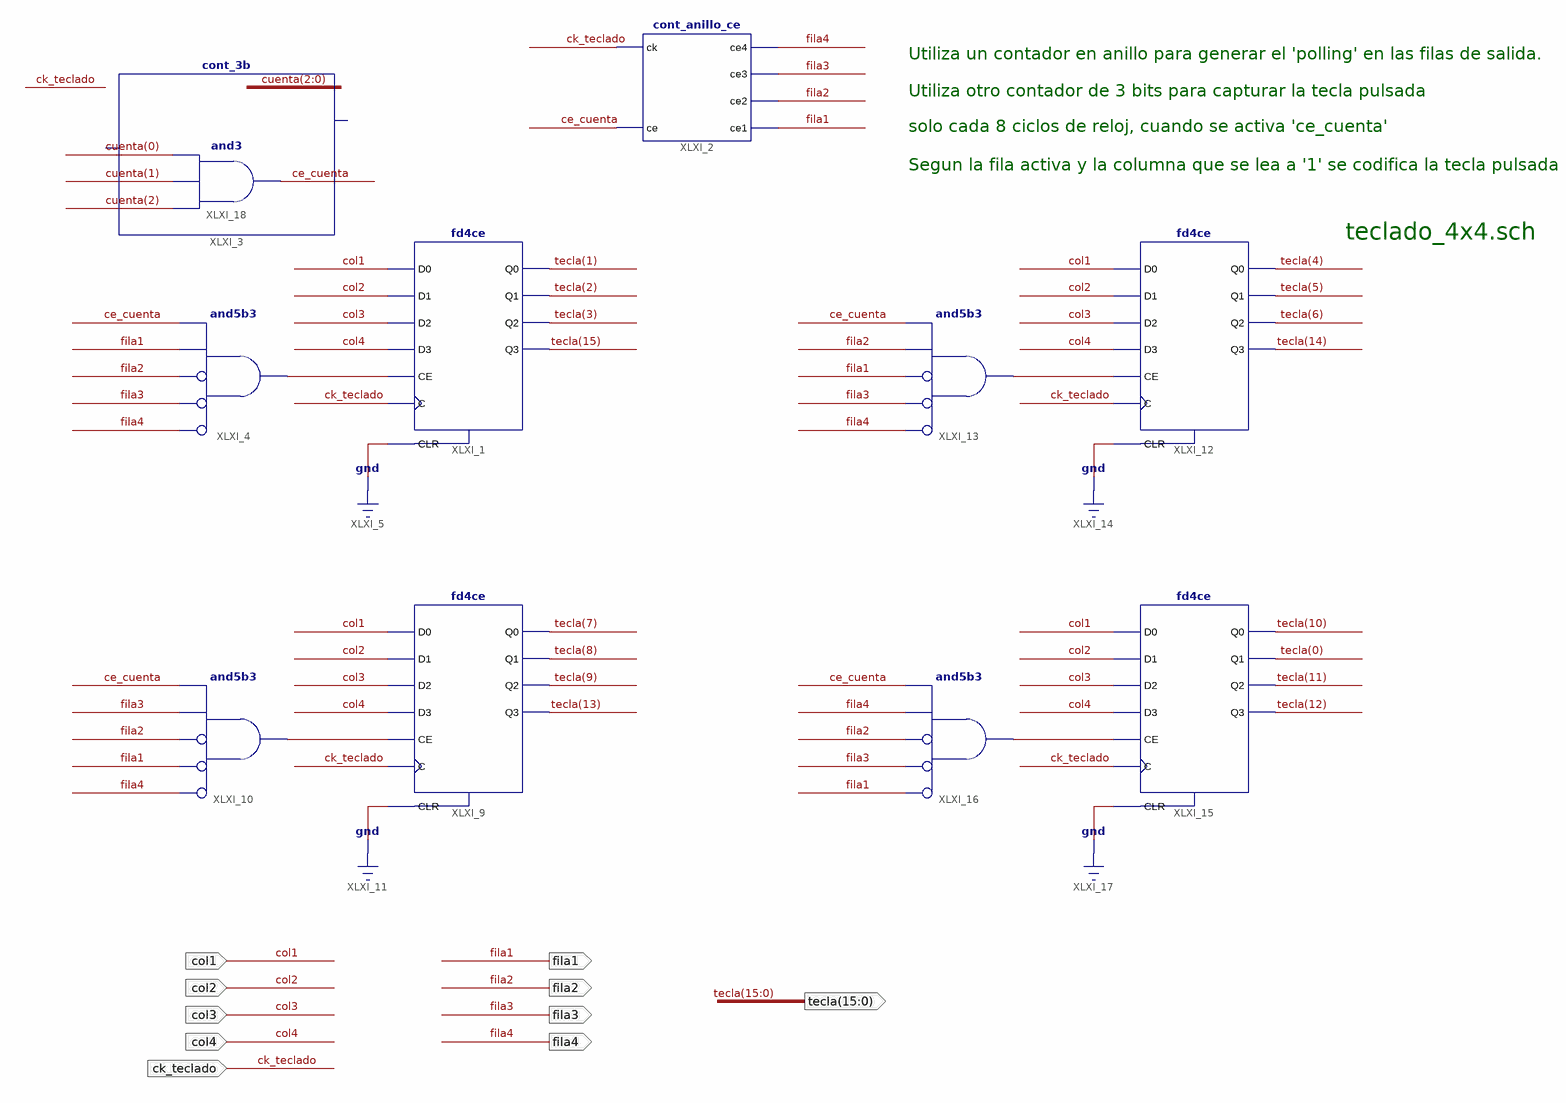
[diagram p0: schematic sheet 1]
// Xilinx ISE schematic teclado_4x4.sch (spartan6) as structural Verilog: 11 symbols, 11 ports
module teclado_4x4 (
  input  ck_teclado,
  input  col1,
  input  col2,
  input  col3,
  input  col4,
  output fila4,
  output fila3,
  output fila2,
  output fila1,
  output [15:0] tecla
);

  wire ce_cuenta, XLXN_13, XLXN_45, XLXN_61, XLXN_77;
  wire [2:0] cuenta;

  fd4ce XLXI_1 (
    .C(ck_teclado), .CE(XLXN_13), .CLR(1'b0), .D0(col1), .D1(col2), .D2(col3), .D3(col4), .Q0(tecla[1]),
    .Q1(tecla[2]), .Q2(tecla[3]), .Q3(tecla[15]));
  and XLXI_4 (XLXN_13, ~fila4, ~fila3, ~fila2, fila1, ce_cuenta);  // and5b3
  fd4ce XLXI_9 (
    .C(ck_teclado), .CE(XLXN_45), .CLR(1'b0), .D0(col1), .D1(col2), .D2(col3), .D3(col4), .Q0(tecla[7]),
    .Q1(tecla[8]), .Q2(tecla[9]), .Q3(tecla[13]));
  and XLXI_10 (XLXN_45, ~fila4, ~fila1, ~fila2, fila3, ce_cuenta);  // and5b3
  fd4ce XLXI_12 (
    .C(ck_teclado), .CE(XLXN_61), .CLR(1'b0), .D0(col1), .D1(col2), .D2(col3), .D3(col4), .Q0(tecla[4]),
    .Q1(tecla[5]), .Q2(tecla[6]), .Q3(tecla[14]));
  and XLXI_13 (XLXN_61, ~fila4, ~fila3, ~fila1, fila2, ce_cuenta);  // and5b3
  fd4ce XLXI_15 (
    .C(ck_teclado), .CE(XLXN_77), .CLR(1'b0), .D0(col1), .D1(col2), .D2(col3), .D3(col4), .Q0(tecla[10]),
    .Q1(tecla[0]), .Q2(tecla[11]), .Q3(tecla[12]));
  and XLXI_16 (XLXN_77, ~fila1, ~fila3, ~fila2, fila4, ce_cuenta);  // and5b3
  cont_anillo_ce XLXI_2 (.ck(ck_teclado), .ce(ce_cuenta), .ce4(fila4), .ce3(fila3), .ce2(fila2), .ce1(fila1));
  cont_3b XLXI_3 (.clk(ck_teclado), .q(cuenta));
  and XLXI_18 (ce_cuenta, cuenta[2], cuenta[1], cuenta[0]);

  // Notes on the sheet:
  //   Utiliza un contador en anillo para generar el 'polling' en las filas de salida.
  //   Utiliza otro contador de 3 bits para capturar la tecla pulsada
  //   solo cada 8 ciclos de reloj, cuando se activa 'ce_cuenta'
  //   Segun la fila activa y la columna que se lea a '1' se codifica la tecla pulsada
  //   teclado_4x4.sch
endmodule
